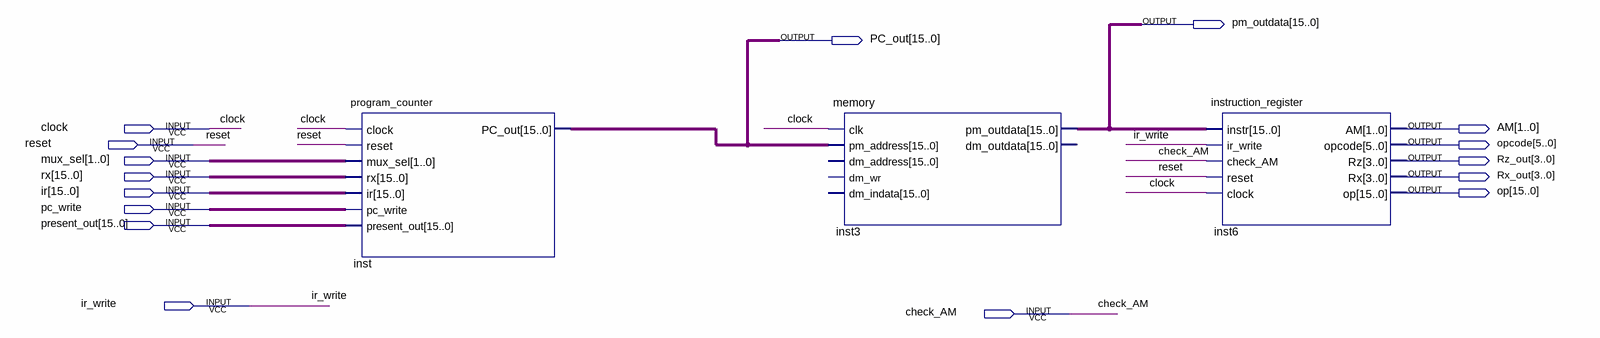
[diagram p0: schematic sheet]
// Quartus schematic Fetch_testbench.bdf as structural Verilog: 3 symbols, 16 pins
module Fetch_testbench (
  input  clock,
  input  reset,
  input  [1:0] mux_sel,
  input  [15:0] rx,
  input  [15:0] ir,
  input  pc_write,
  input  [15:0] present_out,
  input  ir_write,
  input  check_AM,
  output [15:0] pm_outdata,
  output [15:0] PC_out,
  output [1:0] AM,
  output [5:0] opcode,
  output [3:0] Rz_out,
  output [3:0] Rx_out,
  output [15:0] op
);

  program_counter inst (
    .clock(clock), .reset(reset), .mux_sel(mux_sel), .rx(rx), .ir(ir), .pc_write(pc_write),
    .present_out(present_out), .PC_out(PC_out));
  memory inst3 (
    .clk(clock), .pm_address(PC_out), .pm_outdata(pm_outdata));  // open: dm_address, dm_wr, dm_indata, dm_outdata
  instruction_register inst6 (
    .instr(pm_outdata), .ir_write(ir_write), .check_AM(check_AM), .reset(reset), .clock(clock), .AM(AM),
    .opcode(opcode), .Rz(Rz_out), .Rx(Rx_out), .op(op));
endmodule
